# Altium schematic sheet CurrentSensor.SchDoc
size A4
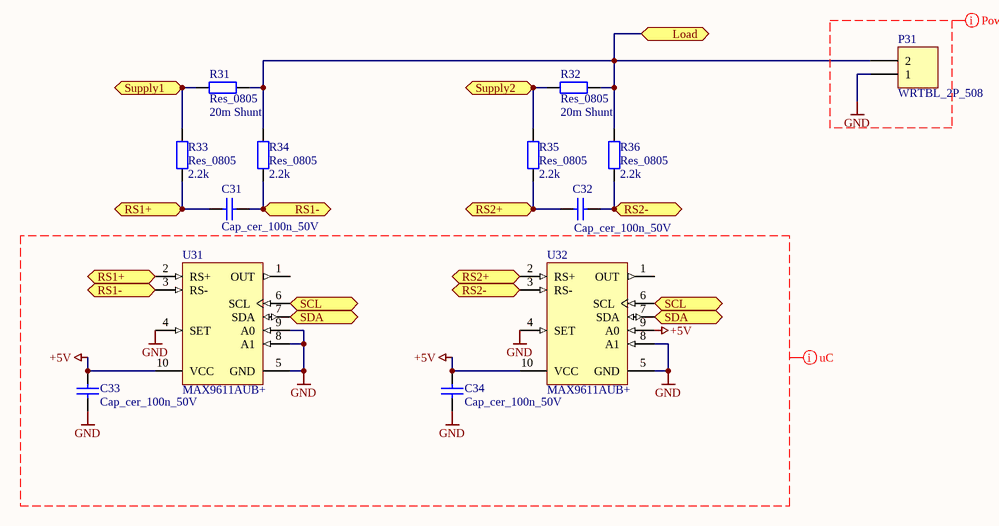
[diagram p0: CurrentSensor.SchDoc]

## Parts
C31  Cap_cer_100n_50V  [_0805]
C32  Cap_cer_100n_50V  [_0805]
C33  Cap_cer_100n_50V  [_0805]
C34  Cap_cer_100n_50V  [_0805]
P31  WRTBL_2P_508  [WRTBL_2P_508]
R31  Res_0805  value 20m Shunt  [_0805]
R32  Res_0805  value 20m Shunt  [_0805]
R33  Res_0805  value 2.2k  [_0805]
R34  Res_0805  value 2.2k  [_0805]
R35  Res_0805  value 2.2k  [_0805]
R36  Res_0805  value 2.2k  [_0805]
U31  MAX9611AUB+  [MAXM-U10+2_N]
U32  MAX9611AUB+  [MAXM-U10+2_N]

## Ports
Load, RS1+, RS1-, RS2+, RS2-, SCL, SDA, Supply1, Supply2

## Nets
+5V: C33.1 C34.2 U31.10(VCC) U32.9(A0) U32.10(VCC)
GND: C33.2 C34.1 P31.1 U31.4(SET) U31.5(GND) U31.8(A1) U31.9(A0) U32.4(SET) U32.5(GND) U32.8(A1)
Load: P31.2 R31.2 R32.2 R34.2 R36.2 ; port Load
RS1+: C31.1 R33.1 U31.2(RS+) ; port RS1+
RS1-: C31.2 R34.1 U31.3(RS-) ; port RS1-
RS2+: C32.1 R35.1 U32.2(RS+) ; port RS2+
RS2-: C32.2 R36.1 U32.3(RS-) ; port RS2-
SCL: U31.6(SCL) U32.6(SCL) ; port SCL
SDA: U31.7(SDA) U32.7(SDA) ; port SDA
Supply1: R31.1 R33.2 ; port Supply1
Supply2: R32.1 R35.2 ; port Supply2

Not connected (* = marked no-connect by the designer): U31 1(OUT); U32 1(OUT)

## Layout directives
net class Power: GND
net class uC: +5V, GND

## Library data of the parts
C31 C32 = Cap_120: QR: 0; Capacity: 100n; Voltage: 50V; UID: Cap_120; Name: Cap_cer_100n_50V; ComponentLink1URL: #NAME?; mounting: SMD
C33 C34 = Cap_124: QR: 0; Capacity: 100n; Voltage: 50V; UID: Cap_124; Name: Cap_cer_100n_50V; ComponentLink1URL: #NAME?; mounting: SMD
P31 = Con_7: RS_number: 193-0586; QR: 0; UID: Con_7; Name: WRTBL_2P_508; Name_Hyperlink: Printklemme 5,08mm 2-polig; ComponentLink1URL: #NAME?; mounting: THT; Pins: 2
R31-R36 = Res_6: UID: Res_6; Name: Res_0805; ComponentLink1URL: #NAME?; mounting: SMD
U31 U32 = MAX9611AUB+: High-side Current-Sense Amplifier with 12-bit I2C ADC and Op Amp / Comparator - Non-inverting, Adjustable Gain, -40 to 125 degC, 10-Pin SOP (U10+2), Pb-Free; Bi-Dir. Curr. Sense: No; Gain: Adj.; DatasheetVersion: Rev. 3; PackageVersion: Rev. L, 07/2008; PackageReference: U10+2; PackageDescription: 10-Pin Micro-MAX, Thin Shrink Small-Outline (U10+2), Body 3 x 3 mm, Pitch 0.5 mm; Supplier 1: Digi-Key; Supplier Part Number 1: MAX9611AUB+-ND; Supplier 2: Farnell; Supplier Part Number 2: 2212297; Supplier 3: Newark; Supplier Part Number 3: 45W6334; Supplier 4: Mouser; Supplier Part Number 4: 700-MAX9611AUB+; Mounting Technology: Surface Mount; Code_JEDEC: MO-187; PartNumber: MAX9611AUB+; ComponentLink1Description: Manufacturer URL; ComponentLink1URL: http://www.maximintegrated.com/; ComponentLink2Description: Datasheet; ComponentLink2URL: http://datasheets.maximintegrated.com/en/ds/MAX9611-MAX9612.pdf; ComponentLink3Description: Package Specification; ComponentLink3URL: http://pdfserv.maximintegrated.com/package_dwgs/21-0061.PDF